# Altium schematic sheet logi-cam-mt9v-top.SchDoc: PMOD Camera Adapter
size A; Engineer: Michael Jones; DocumentNumber: 1; Revision: RA.1; SheetNumber: 1; SheetTotal: 2; ProjectName: OV7725
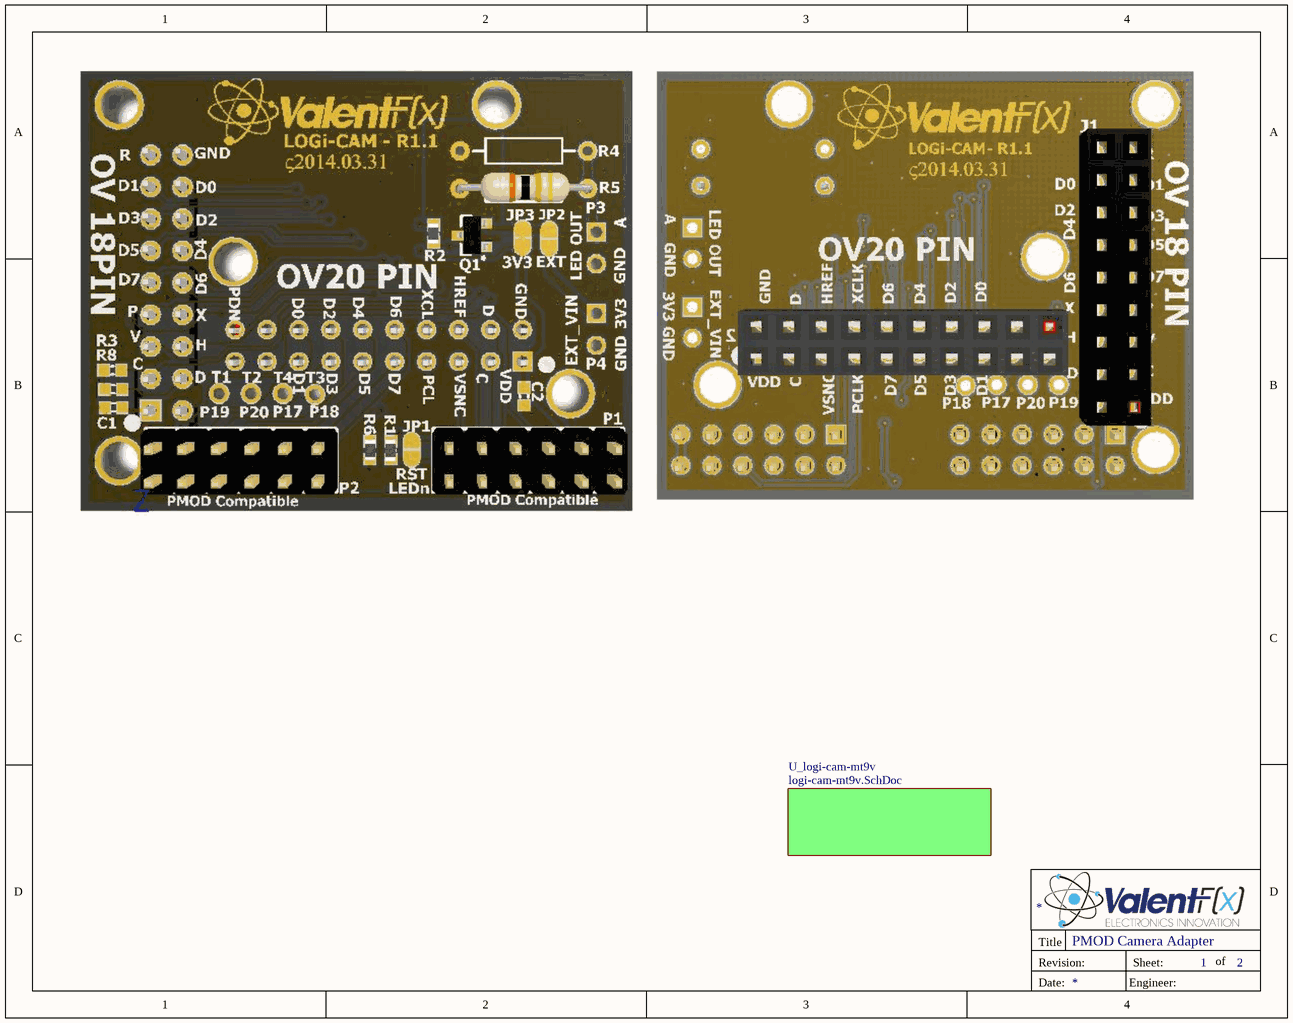
[diagram p0: logi-cam-mt9v-top.SchDoc]

## Sub-sheets
U_logi-cam-mt9v = logi-cam-mt9v.SchDoc: no entries

## Notes on the sheet
- Title
- Revision:
- Sheet:
- of
- Date:
- Engineer: